# EAGLE design ValvePCB V4 (Edit 17-09-2023) (EAGLE 9.6.2)
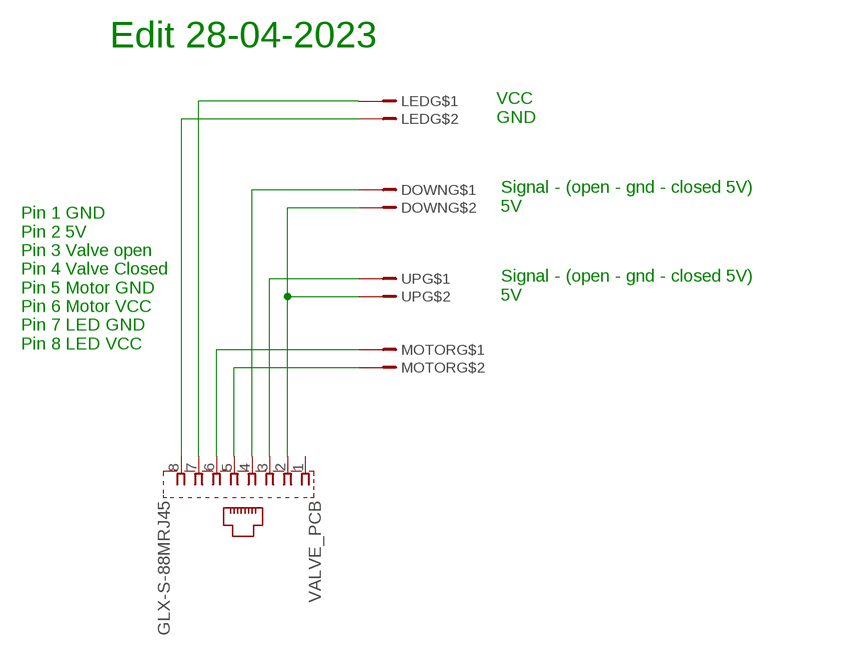
[diagram p0: schematic, sheet 1]

## Parts
DOWN  JST2  [HDRV2W64P254_1X2_712X508X838B]
LED  JST2  [HDRV2W64P254_1X2_712X508X838B]
MOTOR  JST2  [HDRV2W64P254_1X2_712X508X838B]
UP  JST2  [HDRV2W64P254_1X2_712X508X838B]
VALVE_PCB  GLX-S-88MRJ45  [GLX-S-88M]

## Nets
N$1: MOTOR.1 VALVE_PCB.6
N$2: MOTOR.2 VALVE_PCB.5
N$3: UP.1 VALVE_PCB.3
N$5: DOWN.2 UP.2 VALVE_PCB.2
N$6: DOWN.1 VALVE_PCB.4
N$7: LED.2 VALVE_PCB.8
N$8: LED.1 VALVE_PCB.7
Unconnected: VALVE_PCB.1

## Notes on the sheet
- Edit 28-04-2023
- VCC 
  GND
- Signal - (open - gnd - closed 5V)
  5V
- Signal - (open - gnd - closed 5V)
  5V
- Pin 1 GND
  Pin 2 5V
  Pin 3 Valve open
  Pin 4 Valve Closed
  Pin 5 Motor GND
  Pin 6 Motor VCC
  Pin 7 LED GND
  Pin 8 LED VCC

## Library data of the parts
DOWN LED MOTOR UP = con-jstedited:JST2
VALVE_PCB = con-kyconedited:GLX-S-88M: Mod. Jack, Right Angle, 8 posiotion, 8 contatcs RJ45 Source: GLX-S-88M.pdf; OC_FARNELL: unknown; OC_NEWARK: unknown

## Board
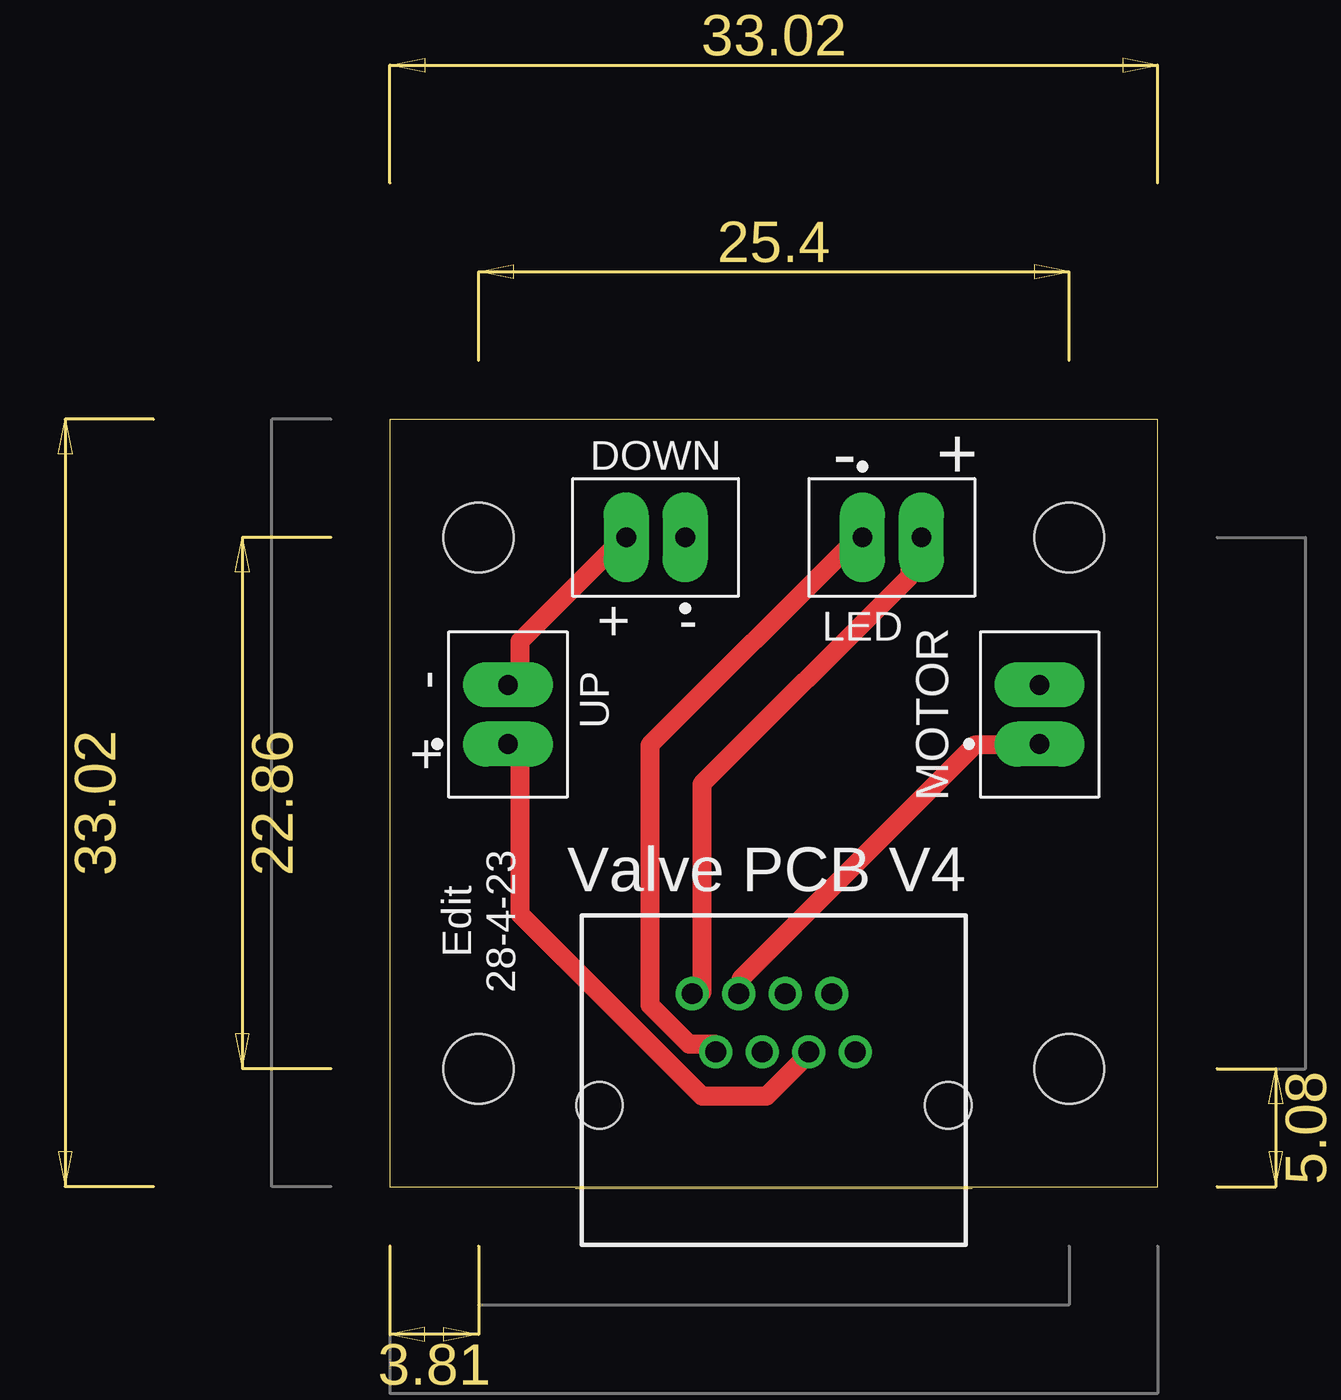
[diagram p1: board, top side]
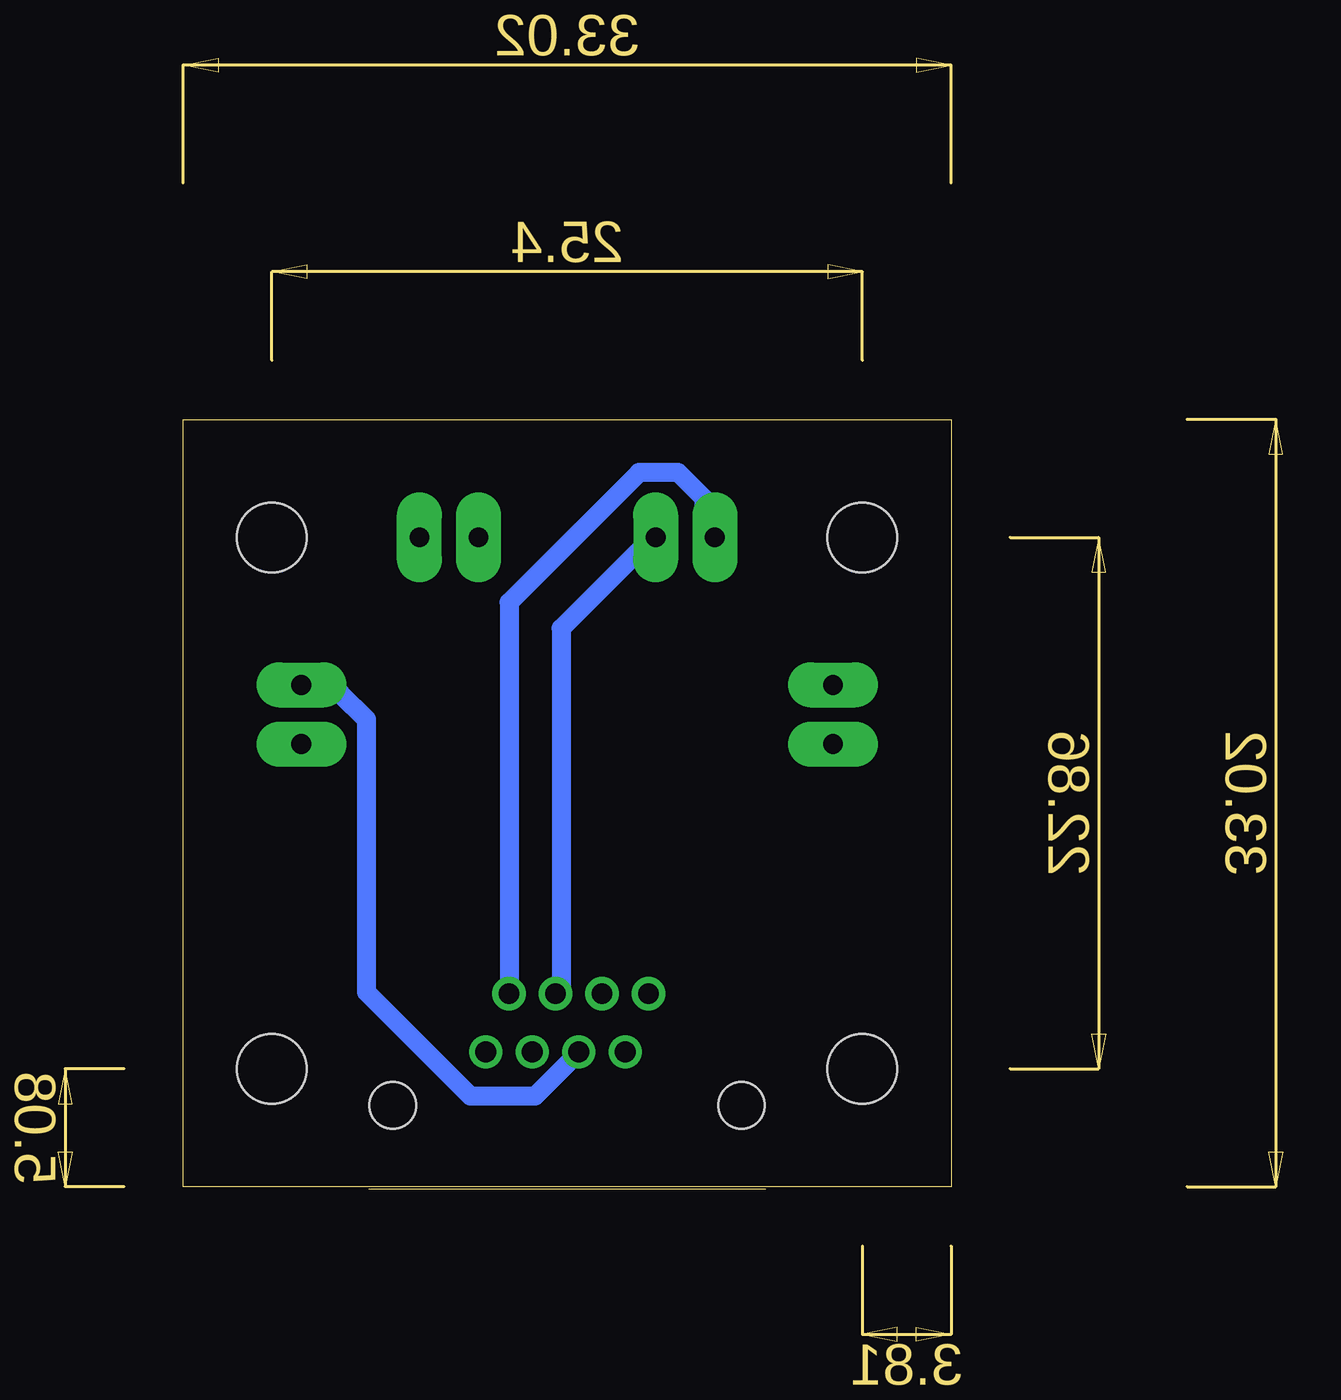
[diagram p2: board, bottom side, seen from below]

Size 33.02 x 33.01 mm. Coordinates in mm from the lower left corner, seen from the top.
Outline: 0,0 33.02,0 33.02,33.01 0,33.01 0,0
Copper layers (1*16): Top 0.035mm / dielectric 1.5mm / Bottom 0.035mm
Design rules "default *": minimum track width 32mil, minimum drill 0.35mm, track to track 12mil, track to pad 12mil, pad to pad 12mil, via to via 12mil, smd to smd 6mil, copper to edge 40mil, drill to drill 6mil, minimum pad ring 10mil, minimum via ring 8mil, stop-mask expansion 4mil, vias tented up to drill 0mil, thermal gap 10mil
Holes 3 mm at 3.81,5.08 3.81,27.94 29.21,27.94 29.21,5.08

### Footprints (pad centres in the part's own frame; a part is rotated, then mirrored left to right if it is on the bottom)
HDRV2W64P254_1X2_712X508X838B = drill 0.85 pad 1.93 long: 1 0,0; 2 2.54,0
GLX-S-88M = drill 0.9 pad 1.422: 1 -3.5,-2; 2 -2.5,-4.5; 3 -1.5,-2; 4 -0.5,-4.5; 5 0.5,-2; 6 1.5,-4.5; 7 2.5,-2; 8 3.5,-4.5 | hole 2: -7.5,0.3; 7.5,0.3

### Placement (x,y rotation side)
DOWN  12.7,27.94 180 top
LED  20.32,27.94 0 top
MOTOR  27.94,19.05 90 top
UP  5.08,19.05 90 top
VALVE_PCB  16.51,3.81 180 top

### Tracks (layer width: path | path; a pad name or v marks a point on that pad's centre or on a via)
N$1
  Top 0.813: VALVE_PCB.6 15.09,8.38 15.09,8.94 25.15,19 27.94,19 MOTOR.1
N$2
  Bottom 0.813: VALVE_PCB.5 16.2,5.59 17.88,3.91 20.68,3.91 25.15,8.38 25.15,20.12 26.26,21.23 27.94,21.23 MOTOR.2
N$3
  Top 0.813: VALVE_PCB.3 17.88,5.59 16.2,3.91 13.41,3.91 5.59,11.73 5.59,19 UP.1
N$5
  Top 0.813: UP.2 5.59,21.79 5.59,23.47 10.06,27.94 DOWN.2
  Bottom 0.813: VALVE_PCB.2 19,8.38 19,25.15 13.41,30.73 11.73,30.73 10.62,29.62 10.62,27.94 DOWN.2
N$6
  Bottom 0.813: VALVE_PCB.4 16.76,8.38 16.76,24.03 12.85,27.94 DOWN.1
N$7
  Top 0.813: VALVE_PCB.8 13.41,8.38 13.41,17.32 22.35,26.26 22.35,27.94 LED.2
N$8
  Top 0.813: VALVE_PCB.7 13.97,6.15 12.85,6.15 11.18,7.82 11.18,19 20.12,27.94 LED.1

### Text on the board
tPlace: Valve PCB V4
tNames: - + | + - | + - | Edit / 28-4-23